# Altium schematic sheet PlausibilityTrigger.SchDoc
size A
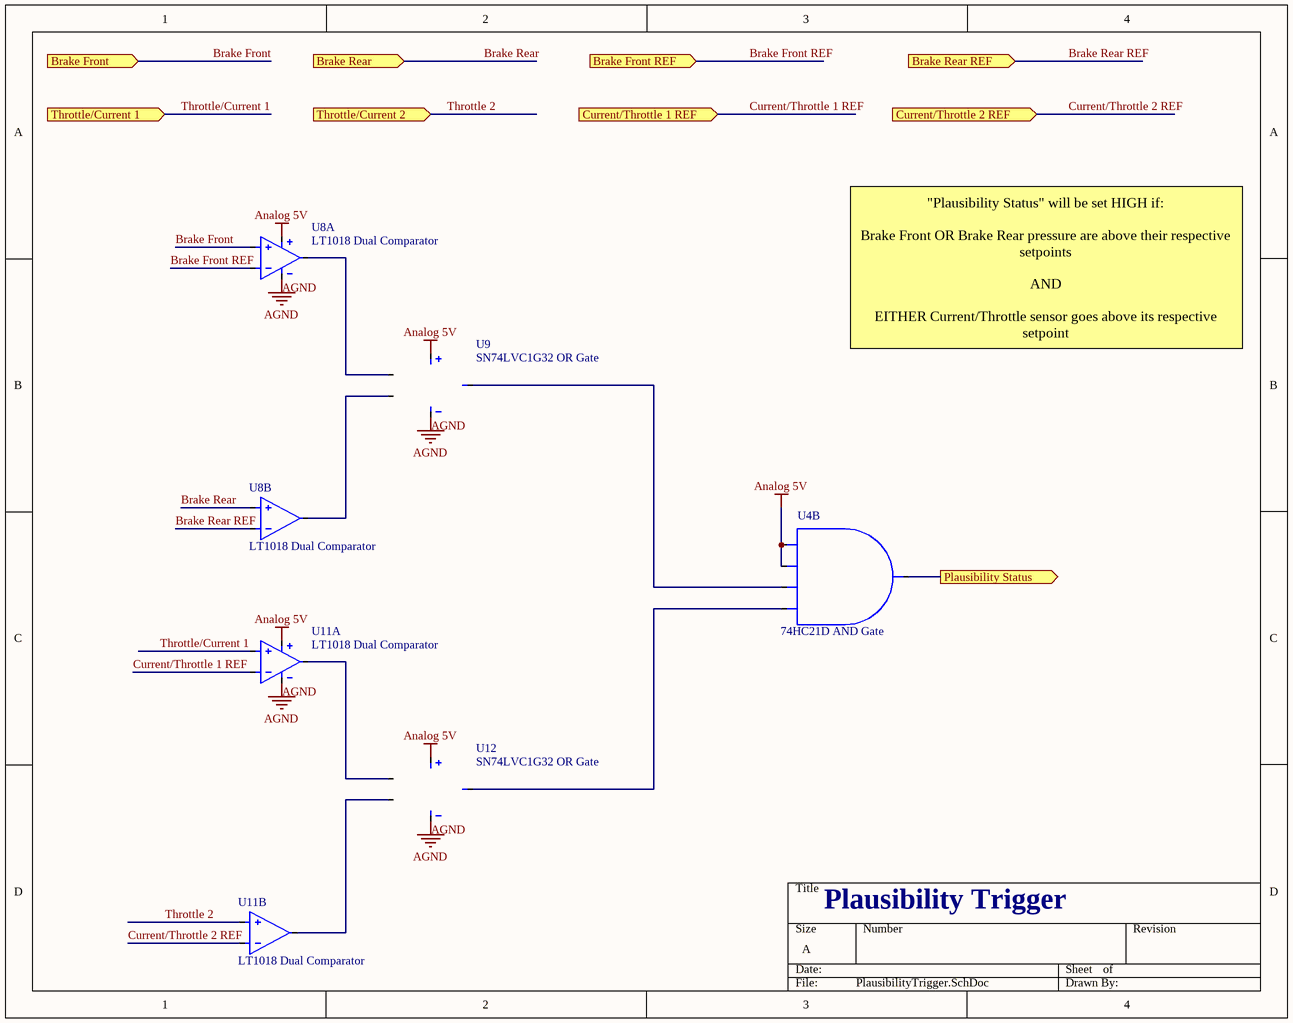
[diagram p0: PlausibilityTrigger.SchDoc]

## Parts
U4  74HC21D AND Gate  [SOT108-1]  (part B of 2)
U8  LT1018 Dual Comparator  [SOIC-8]  (parts A,B of 2)
U9  SN74LVC1G32 OR Gate  [SOT23-5]
U11  LT1018 Dual Comparator  [SOIC-8]  (parts A,B of 2)
U12  SN74LVC1G32 OR Gate  [SOT23-5]

## Ports
Brake Front (in), Brake Front REF (in), Brake Rear (in), Brake Rear REF (in), Current/Throttle 1 REF (in), Current/Throttle 2 REF (in), Plausibility Status (out), Throttle/Current 1 (in), Throttle/Current 2 (in)

## Nets
AGND: U8.2(V-) U9.3(GND) U11.2(V-) U12.3(GND)
Analog 5V: U4.9(2A) U4.10(2B) U8.6(V+) U9.5(Vcc) U11.6(V+) U12.5(Vcc)
Brake Front: U8.1(+IN_A) ; port Brake Front
Brake Front REF: U8.8(-IN_A) ; port Brake Front REF
Brake Rear: U8.3(+IN_B) ; port Brake Rear
Brake Rear REF: U8.4(-IN_B) ; port Brake Rear REF
Current/Throttle 1 REF: U11.8(-IN_A) ; port Current/Throttle 1 REF
Current/Throttle 2 REF: U11.4(-IN_B) ; port Current/Throttle 2 REF
Plausibility Status: U4.8(2Y) ; port Plausibility Status
Throttle 2: U11.3(+IN_B) ; port Throttle/Current 2
Throttle/Current 1: U11.1(+IN_A) ; port Throttle/Current 1
NetU4_12: U4.12(2C) U9.4(B)
NetU4_13: U4.13(2D) U12.4(B)
NetU8_5: U8.5(OUT_B) U9.2(B)
NetU8_7: U8.7(OUT_A) U9.1(A)
NetU11_5: U11.5(OUT_B) U12.2(B)
NetU11_7: U11.7(OUT_A) U12.1(A)

## Notes on the sheet
- "Plausibility Status" will be set HIGH if:
  Brake Front OR Brake Rear pressure are above their respective setpoints
  AND
  EITHER Current/Throttle sensor goes above its respective setpoint
- Plausibility Trigger

## Library data of the parts
U4 = 15: 74HC21D_AND_Gate; id: 15; DualAND: Plaus+BSPDAND; quantity: 0
U8 = 7: id: 7; name: LT1018CS8#PBF; Comparator Designator: PT1; quantity: 0; link: https://www.digikey.com/product-detail/en/lin
U9 U12 = 14: id: 14; quantity: 0
U11 = 7: id: 7; name: LT1018CS8#PBF; Comparator Designator: PT2; quantity: 0; link: https://www.digikey.com/product-detail/en/lin